# EAGLE schematic tic_tac_toe_wire (EAGLE 6.4)
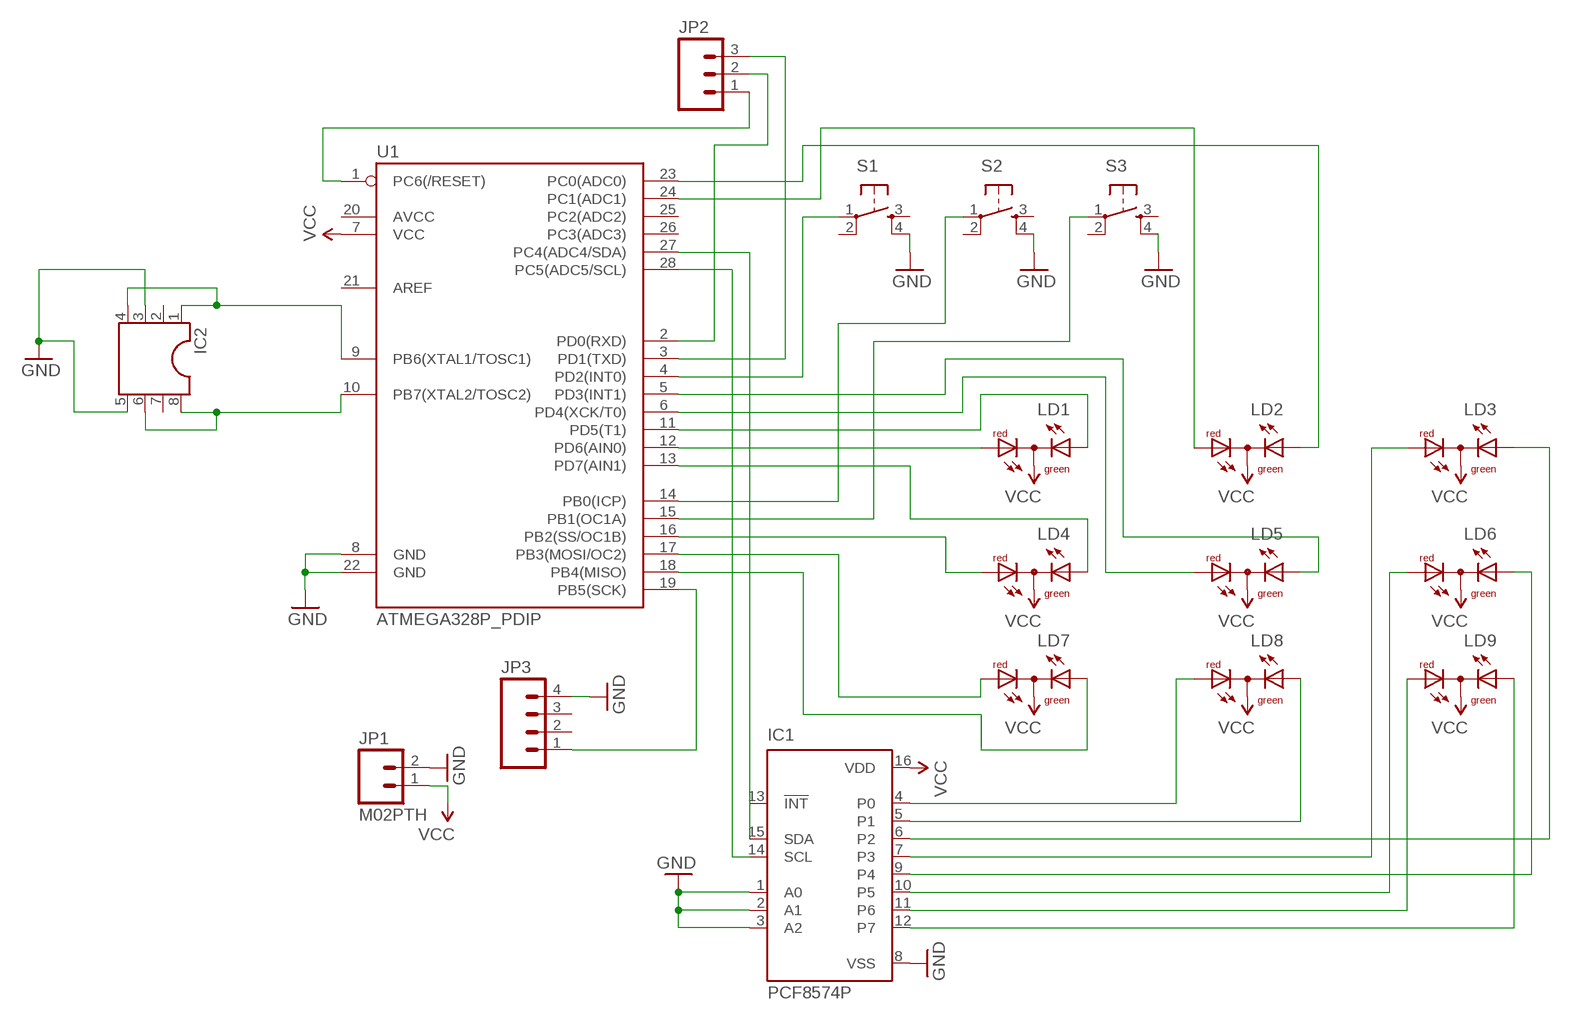
[diagram p0: schematic, sheet 1]

## Parts
IC1  PCF8574P  [DIL16]
IC2  DIL8S  [SOCKET-08]
JP1  M02PTH  [1X02]
JP2  M03PTH  [1X03]
JP3  M04PTH  [1X04]
LD1  DUOLED-RG-C  [DUOLED-C-5MM]
LD2  DUOLED-RG-C  [DUOLED-C-5MM]
LD3  DUOLED-RG-C  [DUOLED-C-5MM]
LD4  DUOLED-RG-C  [DUOLED-C-5MM]
LD5  DUOLED-RG-C  [DUOLED-C-5MM]
LD6  DUOLED-RG-C  [DUOLED-C-5MM]
LD7  DUOLED-RG-C  [DUOLED-C-5MM]
LD8  DUOLED-RG-C  [DUOLED-C-5MM]
LD9  DUOLED-RG-C  [DUOLED-C-5MM]
S1  TAC_SWITCHPTH  [TACTILE-PTH]
S2  TAC_SWITCHPTH  [TACTILE-PTH]
S3  TAC_SWITCHPTH  [TACTILE-PTH]
U1  ATMEGA328P_PDIP  [DIL28-3]

## Nets
GND: IC1.1(A0) IC1.2(A1) IC1.3(A2) IC1.8(VSS) IC2.3 IC2.5 JP1.2 JP3.4 S1.4 S2.4 S3.4 U1.8(GND) U1.22(GND)
N$1: S1.1 U1.4(PD2(INT0))
N$2: S2.1 U1.14(PB0(ICP))
N$3: S3.1 U1.15(PB1(OC1A))
N$4: IC1.14(SCL) U1.28(PC5(ADC5/SCL))
N$5: IC1.15(SDA) U1.27(PC4(ADC4/SDA))
N$6: JP2.2 U1.2(PD0(RXD))
N$7: JP2.1 U1.1(PC6(/RESET))
N$8: JP2.3 U1.3(PD1(TXD))
N$10: JP3.1 U1.19(PB5(SCK))
N$12: IC2.6 IC2.8 U1.10(PB7(XTAL2/TOSC2))
N$13: IC2.1 IC2.4 U1.9(PB6(XTAL1/TOSC1))
N$15: IC1.12(P7) LD9.AX(AG)
N$16: IC1.11(P6) LD9.AR
N$17: IC1.10(P5) LD6.AR
N$18: IC1.9(P4) LD6.AX(AG)
N$19: IC1.7(P3) LD3.AR
N$20: IC1.6(P2) LD3.AX(AG)
N$21: IC1.5(P1) LD8.AX(AG)
N$22: IC1.4(P0) LD8.AR
N$23: LD7.AX(AG) U1.18(PB4(MISO))
N$24: LD7.AR U1.17(PB3(MOSI/OC2))
N$25: LD4.AR U1.16(PB2(SS/OC1B))
N$26: LD4.AX(AG) U1.13(PD7(AIN1))
N$27: LD1.AR U1.12(PD6(AIN0))
N$28: LD1.AX(AG) U1.11(PD5(T1))
N$29: LD5.AR U1.6(PD4(XCK/T0))
N$30: LD5.AX(AG) U1.5(PD3(INT1))
N$31: LD2.AX(AG) U1.23(PC0(ADC0))
N$32: LD2.AR U1.24(PC1(ADC1))
VCC: IC1.16(VDD) JP1.1 LD1.C LD2.C LD3.C LD4.C LD5.C LD6.C LD7.C LD8.C LD9.C U1.7(VCC)
Unconnected: IC1.13(!INT) IC2.2 IC2.7 JP3.2 JP3.3 S1.2 S1.3 S2.2 S2.3 S3.2 S3.3 U1.20(AVCC) U1.21(AREF) U1.25(PC2(ADC2)) U1.26(PC3(ADC3))

## Library data of the parts
IC1 = micro-philips:PCF8574: I2C-Bus Remote 8-bit I/O expander http://www.semiconductors.philips.com/acrobat_download/datasheets/PCF8574_4.pdf; MPN: PCF8574PN; OC_FARNELL: 204020; OC_NEWARK: 11N8515
IC2 = ic-package:DIL8: Dual In Line / Socket
JP1 = SparkFun-Connectors:M02: Standard 2-pin 0.1" header. Use with - straight break away headers ( PRT-00116) - right angle break away headers (PRT-00553) - swiss pins (PRT-00743) - machine pins (PRT-00117) - female headers (PRT-00115) Molex polarized connector foot print use with: PRT-08233 with associated crimp pins and housings. 2.54_SCREWTERM for use with PRT-10571. 3.5mm Screw Terminal footprints for PRT-08084 5mm Screw Terminal footprints for use with PRT-08433
JP2 = SparkFun-Connectors:M03: Header 3 Standard 3-pin 0.1" header. Use with straight break away headers (SKU : PRT-00116), right angle break away headers (PRT-00553), swiss pins (PRT-00743), machine pins (PRT-00117), and female headers (PRT-00115). Molex polarized connector foot print use with SKU : PRT-08232 with associated crimp pins and housings.
JP3 = SparkFun-Connectors:M04: Header 4 Standard 4-pin 0.1" header. Use with straight break away headers (SKU : PRT-00116), right angle break away headers (PRT-00553), swiss pins (PRT-00743), machine pins (PRT-00117), and female headers (PRT-00115). Molex polarized connector foot print use with SKU : PRT-08231 with associated crimp pins and housings. 1MM SMD Version SKU: PRT-10208
LD1-LD9 = led:DUOLED-RG-C: DUO LED 2 colors (red/green), 5 mm, round, common Cathode www.ligitek.com or other producers.
S1-S3 = SparkFun-Electromechanical:TAC_SWITCH: Momentary Switch Button commonly used for reset or general input. Spark Fun Electronics SKU : COM-00097 SMT- SWCH-08247
U1 = SparkFun-DigitalIC:ATMEGA328P_PDIP: uC used in the Arduino 32kb flash, 1k EEPROM, 2k SRAM This is the through-hole version of this chip.

## Net classes
0 default: width 0.406 mm, drill 0.508 mm, clearance 0.254 mm